# EAGLE schematic working (EAGLE 9.5.2)
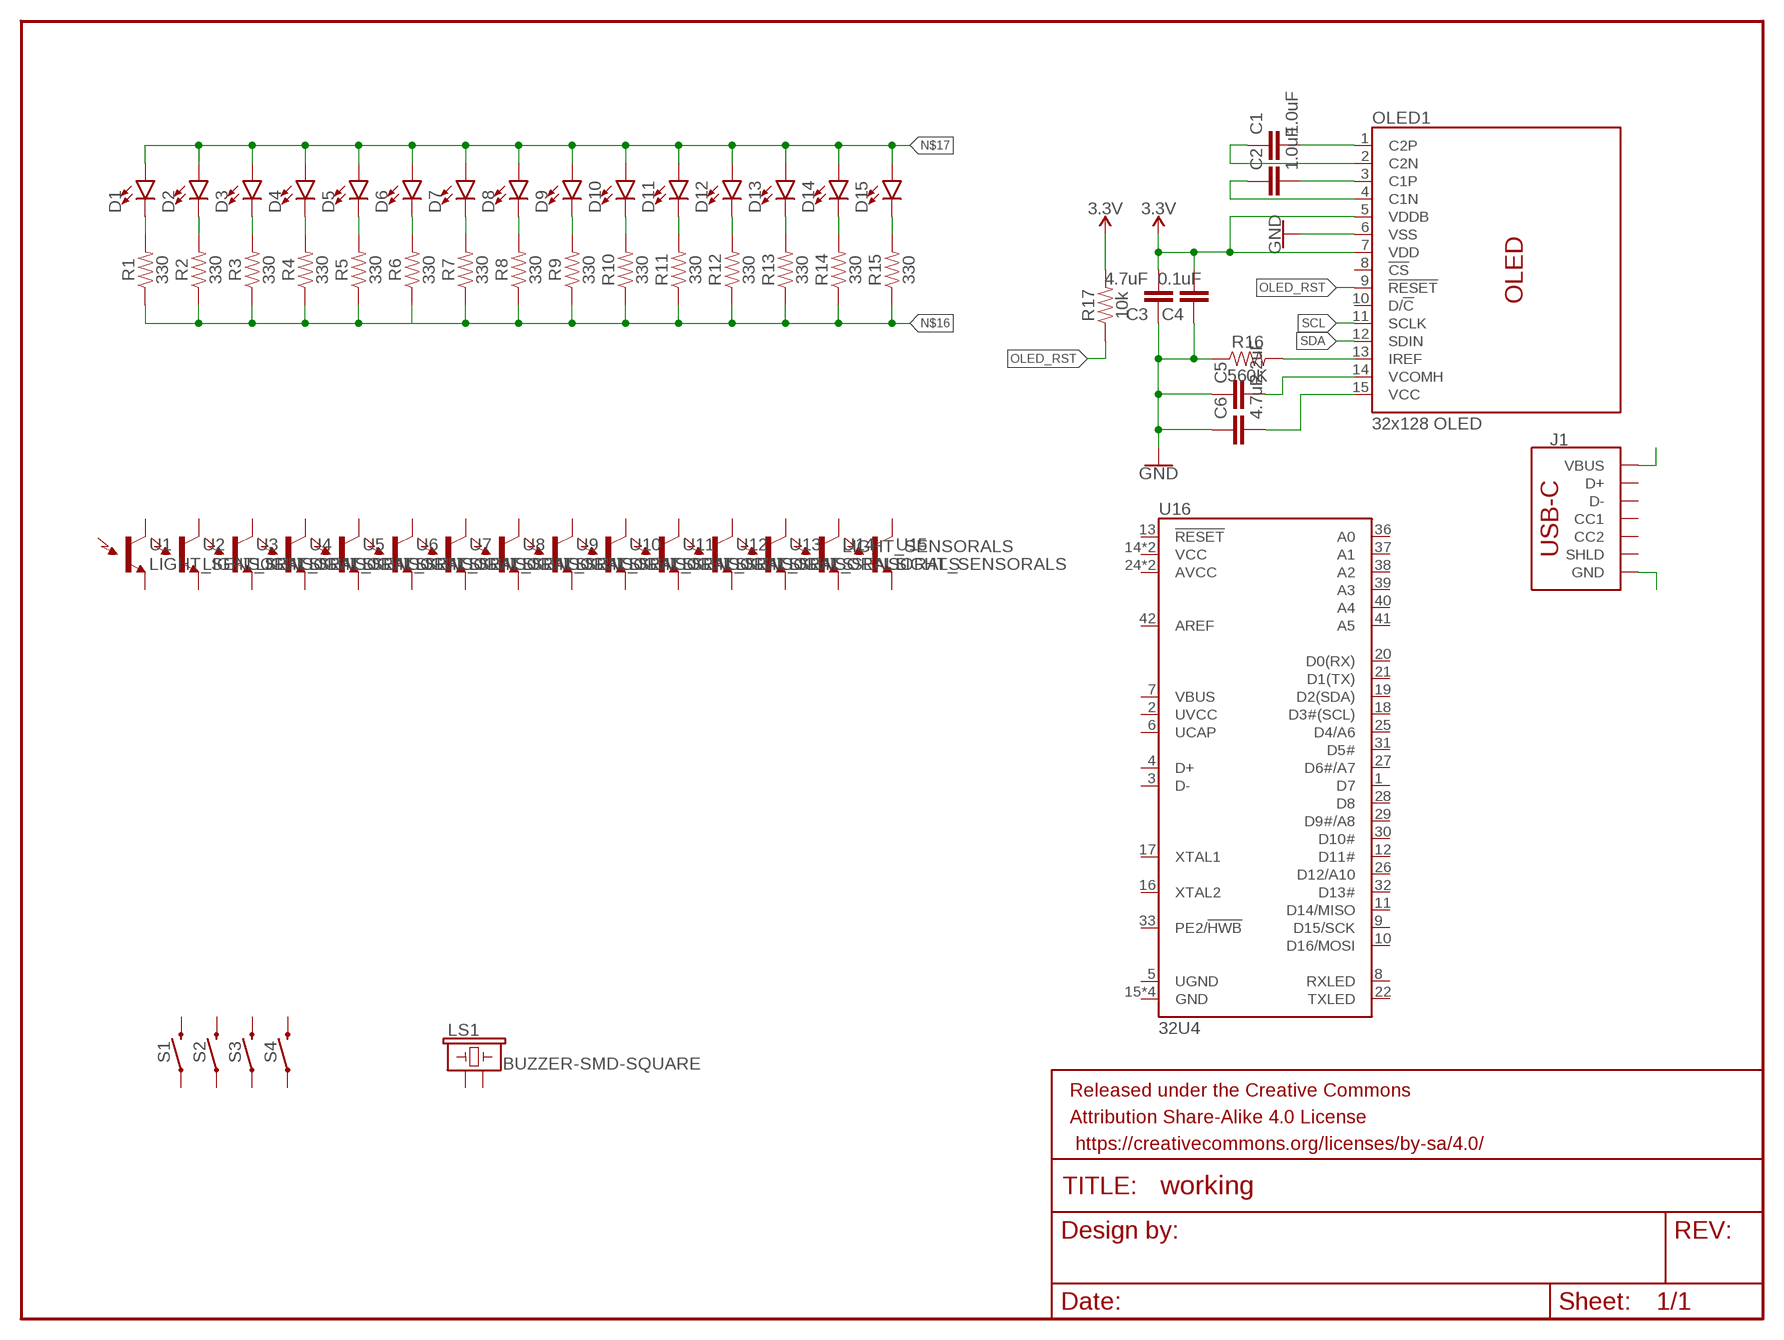
[diagram p0: schematic, sheet 1]

## Parts
C1  1.0uF  1.0UF-0603-16V-10%  [0603]
C2  1.0uF  1.0UF-0603-16V-10%  [0603]
C3  4.7uF  4.7UF-0603-35V-(20%)  [0603]
C4  0.1uF  0.1UF-0603-100V-10%  [0603]
C5  2.2uF  2.2UF-0603-10V-20%  [0603]
C6  4.7uF  4.7UF-0603-35V-(20%)  [0603]
D1  LED0603  [LED-0603]
D2  LED0603  [LED-0603]
D3  LED0603  [LED-0603]
D4  LED0603  [LED-0603]
D5  LED0603  [LED-0603]
D6  LED0603  [LED-0603]
D7  LED0603  [LED-0603]
D8  LED0603  [LED-0603]
D9  LED0603  [LED-0603]
D10  LED0603  [LED-0603]
D11  LED0603  [LED-0603]
D12  LED0603  [LED-0603]
D13  LED0603  [LED-0603]
D14  LED0603  [LED-0603]
D15  LED0603  [LED-0603]
FRAME1  FRAME-LETTER  [CREATIVE_COMMONS]
J1  USB_C_2-LAYER_PADS  [USB-C-16P-2LAYER-PADS]
LS1  BUZZER-SMD-SQUARE  [BUZZER_SMD]
OLED1  32x128 OLED  OLED128X64SIDEREAR-MOUNT  [OLED-UG-2832TSWGG01-REAR]
R1  330  330OHM-0603-1/10W-1%  [0603]
R2  330  330OHM-0603-1/10W-1%  [0603]
R3  330  330OHM-0603-1/10W-1%  [0603]
R4  330  330OHM-0603-1/10W-1%  [0603]
R5  330  330OHM-0603-1/10W-1%  [0603]
R6  330  330OHM-0603-1/10W-1%  [0603]
R7  330  330OHM-0603-1/10W-1%  [0603]
R8  330  330OHM-0603-1/10W-1%  [0603]
R9  330  330OHM-0603-1/10W-1%  [0603]
R10  330  330OHM-0603-1/10W-1%  [0603]
R11  330  330OHM-0603-1/10W-1%  [0603]
R12  330  330OHM-0603-1/10W-1%  [0603]
R13  330  330OHM-0603-1/10W-1%  [0603]
R14  330  330OHM-0603-1/10W-1%  [0603]
R15  330  330OHM-0603-1/10W-1%  [0603]
R16  560K  750KOHM-0603-1/10W-1%  [0603]
R17  10k  10KOHM-0603-1/10W-1%  [0603]
S1  MOMENTARY-SWITCH-SPST-SMD-5.2MM-TALL  [TACTILE_SWITCH_SMD_5.2MM]
S2  MOMENTARY-SWITCH-SPST-SMD-5.2MM-TALL  [TACTILE_SWITCH_SMD_5.2MM]
S3  MOMENTARY-SWITCH-SPST-SMD-5.2MM-TALL  [TACTILE_SWITCH_SMD_5.2MM]
S4  MOMENTARY-SWITCH-SPST-SMD-5.2MM-TALL  [TACTILE_SWITCH_SMD_5.2MM]
U1  LIGHT_SENSORALS  [ALS-PT19]
U2  LIGHT_SENSORALS  [ALS-PT19]
U3  LIGHT_SENSORALS  [ALS-PT19]
U4  LIGHT_SENSORALS  [ALS-PT19]
U5  LIGHT_SENSORALS  [ALS-PT19]
U6  LIGHT_SENSORALS  [ALS-PT19]
U7  LIGHT_SENSORALS  [ALS-PT19]
U8  LIGHT_SENSORALS  [ALS-PT19]
U9  LIGHT_SENSORALS  [ALS-PT19]
U10  LIGHT_SENSORALS  [ALS-PT19]
U11  LIGHT_SENSORALS  [ALS-PT19]
U12  LIGHT_SENSORALS  [ALS-PT19]
U13  LIGHT_SENSORALS  [ALS-PT19]
U14  LIGHT_SENSORALS  [ALS-PT19]
U15  LIGHT_SENSORALS  [ALS-PT19]
U16  32U4  ATMEGA32U4-ARDUINO1:1-LESS_PASTE  [QFN-44-NOPAD_1:1-LESS_PASTE]

## Nets
3.3V: C3.2 C4.2 OLED1.5(VDDB) OLED1.7(VDD) R17.2
GND: C3.1 C4.1 C5.1 C6.1 OLED1.6(VSS) R16.1
N$1: D1.C R1.2
N$2: D2.C R2.2
N$3: D3.C R3.2
N$4: D4.C R4.2
N$5: D5.C R5.2
N$6: D6.C R6.2
N$7: D7.C R7.2
N$8: D8.C R8.2
N$9: D9.C R9.2
N$10: D10.C R10.2
N$11: D11.C R11.2
N$12: D12.C R12.2
N$13: D13.C R13.2
N$14: D14.C R14.2
N$15: D15.C R15.2
N$16: R1.1 R2.1 R3.1 R4.1 R5.1 R6.1 R7.1 R8.1 R9.1 R10.1 R11.1 R12.1 R13.1 R14.1 R15.1
N$17: D1.A D2.A D3.A D4.A D5.A D6.A D7.A D8.A D9.A D10.A D11.A D12.A D13.A D14.A D15.A
N$18: C1.2 OLED1.1(C2P)
N$19: C2.2 OLED1.3(C1P)
N$20: C1.1 OLED1.2(C2N)
N$21: C2.1 OLED1.4(C1N)
N$22: OLED1.13(IREF) R16.2
N$23: J1.VBUS1(VBUS) J1.VBUS2(VBUS)
N$24: C5.2 OLED1.14(VCOMH)
N$25: C6.2 OLED1.15(VCC)
N$26: J1.GND J1.GND2(GND)
OLED_RST: OLED1.9(!RESET!) R17.1
SCL: OLED1.11(SCLK)
SDA: OLED1.12(SDIN)
Unconnected: J1.A5(CC1) J1.A6(D+) J1.A7(D-) J1.B5(CC2) J1.B6(D+) J1.B7(D-) J1.SHLD1(SHLD) J1.SHLD2(SHLD) J1.SHLD3(SHLD) J1.SHLD4(SHLD) LS1.+ LS1.- OLED1.8(!CS!) OLED1.10(D/!C!) S1.1 S1.3 S2.1 S2.3 S3.1 S3.3 S4.1 S4.3 U1.C(C1) U1.E(E1) U2.C(C1) U2.E(E1) U3.C(C1) U3.E(E1) U4.C(C1) U4.E(E1) U5.C(C1) U5.E(E1) U6.C(C1) U6.E(E1) U7.C(C1) U7.E(E1) U8.C(C1) U8.E(E1) U9.C(C1) U9.E(E1) U10.C(C1) U10.E(E1) U11.C(C1) U11.E(E1) U12.C(C1) U12.E(E1) U13.C(C1) U13.E(E1) U14.C(C1) U14.E(E1) U15.C(C1) U15.E(E1) U16.1(D7) U16.2(UVCC) U16.3(D-) U16.4(D+) U16.5(UGND) U16.6(UCAP) U16.7(VBUS) U16.8(RXLED) U16.9(D15/SCK) U16.10(D16/MOSI) U16.11(D14/MISO) U16.12(D11#) U16.13(!RESET) U16.14(VCC) U16.15(GND) U16.16(XTAL2) U16.17(XTAL1) U16.18(D3#(SCL)) U16.19(D2(SDA)) U16.20(D0(RX)) U16.21(D1(TX)) U16.22(TXLED) U16.23(GND) U16.24(AVCC) U16.25(D4/A6) U16.26(D12/A10) U16.27(D6#/A7) U16.28(D8) U16.29(D9#/A8) U16.30(D10#) U16.31(D5#) U16.32(D13#) U16.33(PE2/!HWB) U16.34(VCC) U16.35(GND) U16.36(A0) U16.37(A1) U16.38(A2) U16.39(A3) U16.40(A4) U16.41(A5) U16.42(AREF) U16.43(GND) U16.44(AVCC)

## Library data of the parts
C1 C2 = SparkFun-Capacitors:1.0UF: 1µF ceramic capacitors A capacitor is a passive two-terminal electrical component used to store electrical energy temporarily in an electric field.; PROD_ID: CAP-00868
C3 C6 = SparkFun-Capacitors:4.7UF: 4.7µF ceramic capacitors A capacitor is a passive two-terminal electrical component used to store electrical energy temporarily in an electric field.; PROD_ID: CAP-14106
C4 = SparkFun-Capacitors:0.1UF: 0.1µF ceramic capacitors A capacitor is a passive two-terminal electrical component used to store electrical energy temporarily in an electric field.; PROD_ID: CAP-08390
C5 = SparkFun-Capacitors:2.2UF: 2.2µF ceramic capacitors A capacitor is a passive two-terminal electrical component used to store electrical energy temporarily in an electric field.; PROD_ID: CAP-07888
D1-D15 = SparkFun-LED:LED: LED (Generic) Standard schematic elements and footprints for 5mm, 3mm, 1206, and 0603 sized LEDs. Generic LEDs with no color specified.
FRAME1 = SparkFun-Aesthetics:FRAME-LETTER: Schematic Frame - Letter Standard 8.5x11 US Letter frame
J1 = SparkFun-Connectors:USB_C: USB Type C 16Pin Connector Super Speed pins not available on the 16-pin purely SMD connector so this part is best for USB 2.0 implementations. D1 and D2 are tied together enabling D+/- no matter which way the cable is plugged into the connector. The two channel configuration pins (CC1/2) are exposed. These are normally connected to ground via 5.1k resistors but can be reconfigured for high current/high power applications. **4-LAYER BOARD WARNING!!** If designing 4-layer board, make sure to select the variant _4-LAYER-ISOLATED. The linked footprint (USB-C-16-4LAYER-ISOLATED) includes some very necessary cutout polygons in the inner layers (2 and 15). This prevents the PTH mounting shield legs on the USB connector from electrically connecting any other polygons on the inner layers (usually VCC and GND).; PROD_ID: CONN-14122
LS1 = SparkFun-Electromechanical:BUZZER: Buzzer Small round buzzers that operate around the audible 2kHz range. You can use these as speakers to create simple music or user interfaces. Variant Overview: PTH - Mini Speaker - PC Mount 12mm 2.048kHz <https://www.sparkfun.com/products/7950> PTH_KIT - Mini Speaker - PC Mount 12mm 2.048kHz <https://www.sparkfun.com/products/7950> KIT simplifies soldering by adding stop mask to one side of the pads. PTH_NO_SILK - Mini Speaker - PC Mount 12mm 2.048kHz <https://www.sparkfun.com/products/7950> No silkscreen indicator of buzzer outline. PTH_KIT_NO_SILK - Mini Speaker - PC Mount 12mm 2.048kHz <https://www.sparkfun.com/products/7950> KIT package w/o silkscreen SMD - Buzzer Audio Magnetic (CCV-084B16) SMD buzzer used on, e.g. the LilyPad Buzzer <https://www.sparkfun.com/products/8463> and RFID USB Reader <https://www.sparkfun.com/products/9963>. SMD_KIT - Buzzer Audio Magnetic (CCV-084B16) SMD Buzzer with elongated pins to make soldering easier. Used on the SparkFun Simon Says - Surface Mount Soldering Kit <https://www.sparkfun.com/products/10935>. SMD-SQUARE - Buzzer Audio Magnetic (COMP-15701) SMT square buzzer with one chamfered corner.; PROD_ID: COMP-15701
OLED1 = SparkFun-Displays:OLED128X64SIDE: Micro OLED TODO: Add description SparkFun Products: Product <https://www.sparkfun.com/products/13003>; PROD_ID: LCD-13577
R1-R15 = SparkFun-Resistors:330OHM: 330Ω resistor A resistor is a passive two-terminal electrical component that implements electrical resistance as a circuit element. Resistors act to reduce current flow, and, at the same time, act to lower voltage levels within circuits. - Wikipedia; PROD_ID: RES-00818
R16 = SparkFun-Resistors:750KOHM: 750Ω resistor A resistor is a passive two-terminal electrical component that implements electrical resistance as a circuit element. Resistors act to reduce current flow, and, at the same time, act to lower voltage levels within circuits. - Wikipedia; PROD_ID: RES-13768; VALUE: 750K
R17 = SparkFun-Resistors:10KOHM: 10kΩ resistor A resistor is a passive two-terminal electrical component that implements electrical resistance as a circuit element. Resistors act to reduce current flow, and, at the same time, act to lower voltage levels within circuits. - Wikipedia; PROD_ID: RES-00824
S1-S4 = SparkFun-Switches:MOMENTARY-SWITCH-SPST: Momentary Switch (Pushbutton) - SPST Normally-open (NO) SPST momentary switches (buttons, pushbuttons). Variants PTH-12MM - 12mm square, through-hole Momentary Pushbutton Switch - 12mm Square <https://www.sparkfun.com/products/9190> (COM-09190) PTH-6.0MM, PTH-6.0MM-KIT - 6.0mm square, through-hole Mini Pushbutton Switch <https://www.sparkfun.com/products/97> (COM-00097) KIT package intended for soldering kit's - only one side of pads' copper is exposed. PTH-RIGHT-ANGLE-KIT - Right-angle, through-hole Right Angle Tactile Button <https://www.sparkfun.com/products/10791> - Used on SparkFun BigTime Watch Kit <https://www.sparkfun.com/products/11734> SMD-12MM - 12mm square, surface-mount Tactile Button - SMD (12mm) <https://www.sparkfun.com/products/12993> (COM-12993) Used on SparkFun PicoBoard <https://www.sparkfun.com/products/11888> SMD-4.5MM - 4.5mm Square Trackball Switch Used on SparkFun Blackberry Trackballer Breakout <https://www.sparkfun.com/products/13169> SMD-4.6MMX2.8MM - 4.60mm x 2.80mm, surface mount Used on SparkFun Pro Micro - RP2040 <https://www.sparkfun.com/products/17717> SMD-5.2MM, SMD-5.2-REDUNDANT - 5.2mm square, surface-mount Mini Pushbutton Switch - SMD <https://www.sparkfun.com/products/8720> (COM-08720) Used on Arduino Pro Mini <https://www.sparkfun.com/products/11114> REDUNDANT package connects both switch circuits together SMD-6.0X3.5MM - 6.0 x 3.5mm, surface mount Momentary Reset Switch SMD <https://www.sparkfun.com/products/8229> (COM-08229) SMD-6.2MM-TALL - 6.2mm square, surface mount Tactile Button - SMD (6mm) <https://www.sparkfun.com/products/12992> Used on SparkFun Digital Sandbox <https://www.sparkfun.com/products/12651> SMD-RIGHT-ANGLE - Right-angle, surface mount Used on SparkFun Block for Intel® Edison - Arduino <https://www.sparkfun.com/products/13036>; PROD_ID: SWCH-14139
U1-U15 = SparkFun-Sensors:LIGHT_SENSOR: Ambient Light Sensors - Phototransistors Low cost ambient light sensors, consisting of a phototransistor in miniature SMD packages. Output voltage varies with light intensity. SparkFun Products ALS-PT19 Light Sensor <https://www.sparkfun.com/products/12566> (SEN-12566) Ambient Light Sensor - TEMT6000 <https://www.sparkfun.com/products/8348> (SEN-08348) SparkFun Ambient Light Sensor Breakout - TEMT60000 <https://www.sparkfun.com/products/8688> (SEN-08688); PROD_ID: IC-11836; SF_ID: SEN-12566
U16 = SparkFun-IC-Microcontroller:ATMEGA32U4-ARDUINO: Atmel MCU, 32KByte Atmel 44-pin 8-bit Microcontroller with 32KBytes of ISP Flash and USB Controller Datasheet <http://cdn.sparkfun.com/datasheets/Dev/Arduino/Boards/ATMega32U4.pdf> SparkFun Products LilyPad Arduino USB - ATmega32U4 Board <https://www.sparkfun.com/products/12049> (DEV-12049) Pro Micro - 5V/16MHz <https://www.sparkfun.com/products/12640> (DEV-12640) Pro Micro - 3.3V/8MHz <https://www.sparkfun.com/products/12587> (DEV-12587) Fio v3 - ATmega32U4 <https://www.sparkfun.com/products/11520> (DEV-11520) Qduino Mini <https://www.sparkfun.com/products/13614> (DEV-13614) Makey Makey - Standard Kit <https://www.sparkfun.com/products/11511> (WIG-11511) Makey Makey Deluxe Kit <https://www.sparkfun.com/products/11519> (WIG-11519); PROD_ID: IC-10828